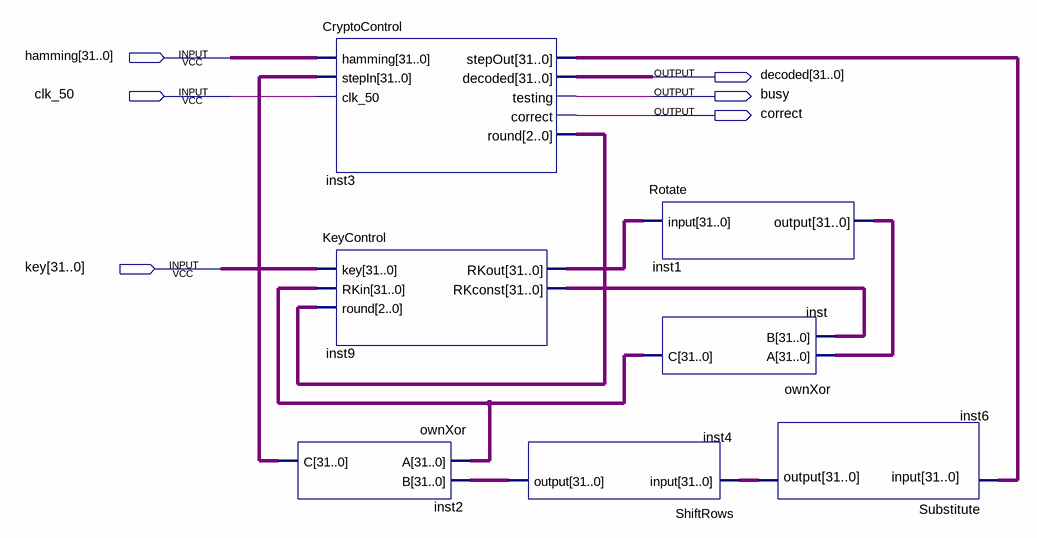
[diagram p0: schematic sheet]
// Quartus schematic Crypto.bdf as structural Verilog: 7 symbols, 6 pins
module Crypto (
  input  [31:0] hamming,
  input  clk_50,
  input  [31:0] key,
  output [31:0] decoded,
  output busy,
  output correct
);

  wire [2:0] inst3_round;
  wire [31:0] inst1_output, inst2_c, inst3_stepout, inst4_output, inst6_output, inst9_rkconst, inst9_rkout,
       inst_c;

  CryptoControl inst3 (
    .hamming(hamming), .stepIn(inst2_c), .clk_50(clk_50), .stepOut(inst3_stepout), .decoded(decoded),
    .testing(busy), .correct(correct), .round(inst3_round));
  KeyControl inst9 (.key(key), .RKin(inst_c), .round(inst3_round), .RKout(inst9_rkout), .RKconst(inst9_rkconst));
  ownXor inst2 (.A(inst_c), .B(inst4_output), .C(inst2_c));
  ShiftRows inst4 (.\input (inst6_output), .\output (inst4_output));
  Rotate inst1 (.\input (inst9_rkout), .\output (inst1_output));
  ownXor inst (.A(inst1_output), .B(inst9_rkconst), .C(inst_c));
  Substitute inst6 (.\input (inst3_stepout), .\output (inst6_output));
endmodule
